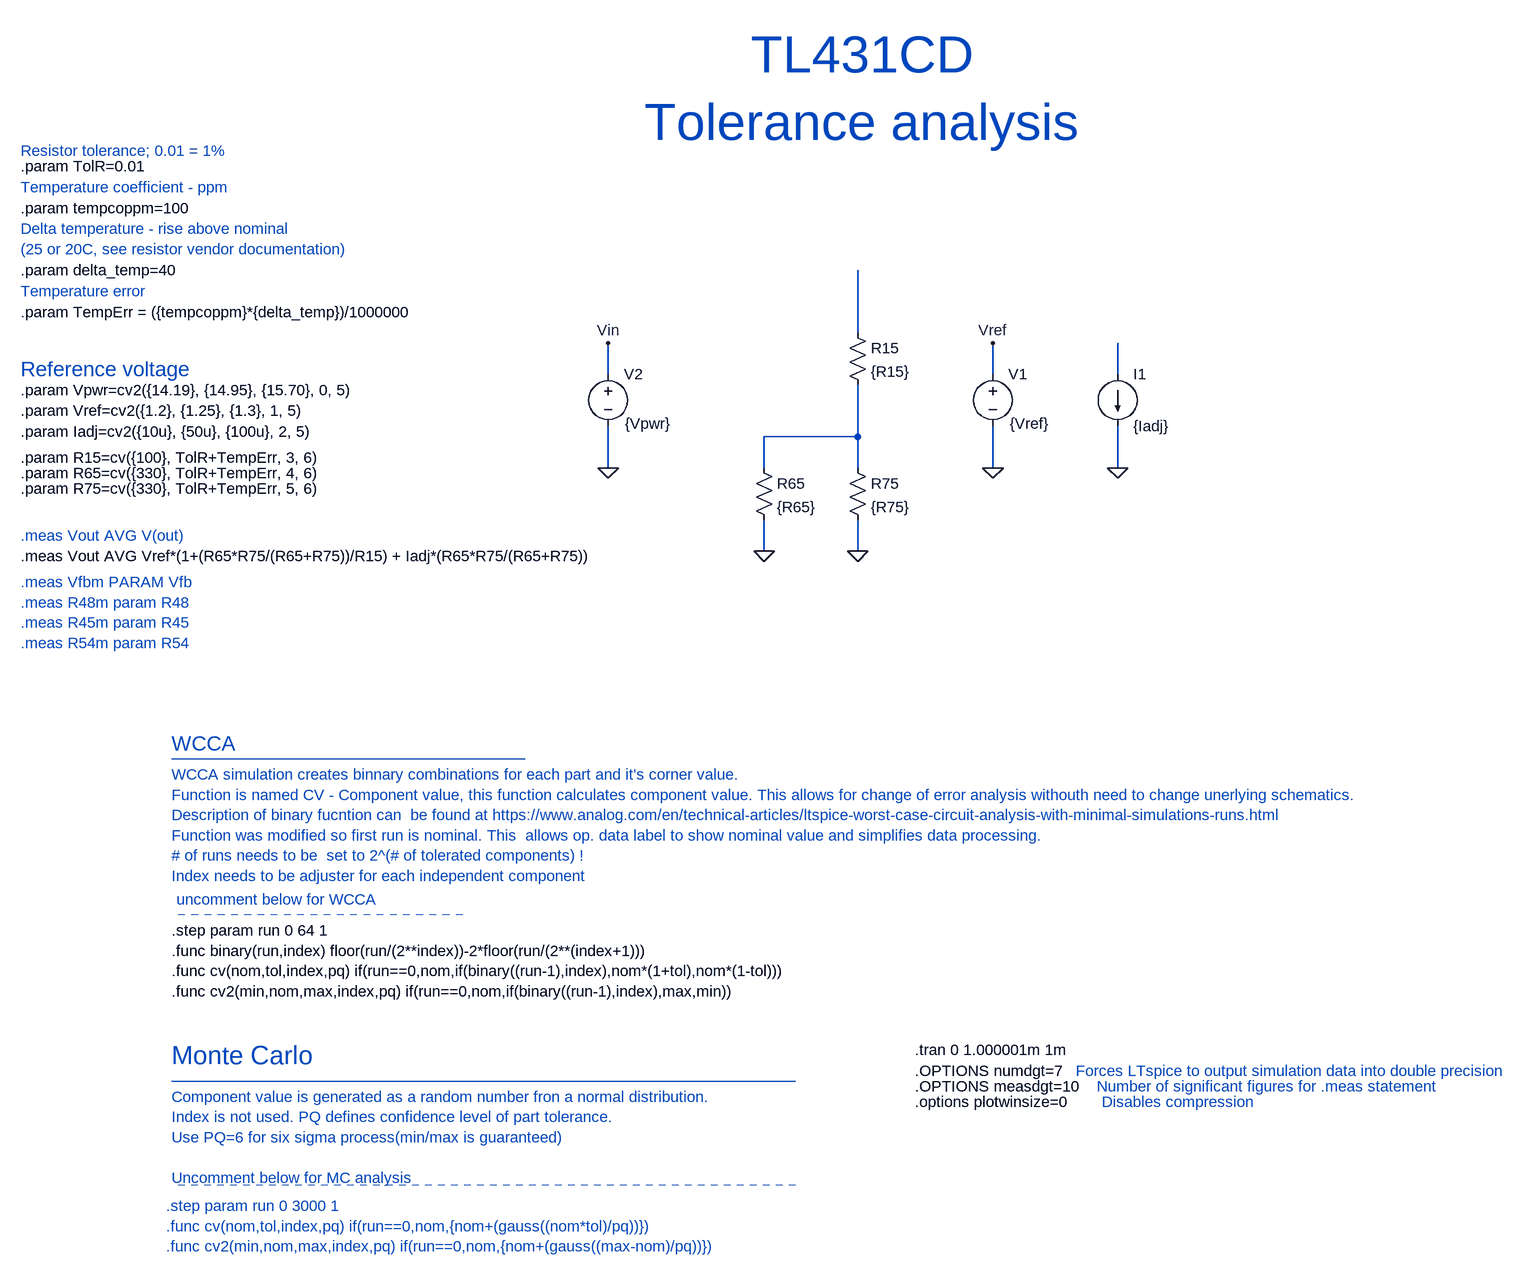
[diagram p0: schematic 3V3.asc]
3V3.asc, the LTspice schematic file:
Version 4
SHEET 1 3608 1236
WIRE 304 -976 304 -1072
WIRE -80 -912 -80 -960
WIRE 512 -912 512 -960
WIRE 704 -912 704 -960
WIRE 304 -816 304 -896
WIRE 304 -816 160 -816
WIRE -80 -768 -80 -832
WIRE 160 -768 160 -816
WIRE 304 -768 304 -816
WIRE 512 -768 512 -832
WIRE 704 -768 704 -832
WIRE 160 -640 160 -688
WIRE 304 -640 304 -688
FLAG 304 -640 0
FLAG 512 -768 0
FLAG -80 -768 0
FLAG -80 -960 Vin
FLAG 512 -960 Vref
FLAG 704 -768 0
FLAG 160 -640 0
SYMBOL res 288 -992 R0
SYMATTR InstName R15
SYMATTR Value {R15}
SYMBOL res 288 -784 R0
SYMATTR InstName R75
SYMATTR Value {R75}
SYMBOL voltage 512 -928 R0
WINDOW 3 26 92 Left 2
WINDOW 123 0 0 Left 0
WINDOW 39 0 0 Left 0
SYMATTR Value {Vref}
SYMATTR InstName V1
SYMBOL res 144 -784 R0
SYMATTR InstName R65
SYMATTR Value {R65}
SYMBOL voltage -80 -928 R0
WINDOW 3 26 92 Left 2
WINDOW 123 0 0 Left 0
WINDOW 39 0 0 Left 0
SYMATTR Value {Vpwr}
SYMATTR InstName V2
SYMBOL current 704 -912 R0
SYMATTR InstName I1
SYMATTR Value {Iadj}
TEXT 392 128 Left 2 !.tran 0 1.000001m 1m
TEXT -752 -56 Left 2 !.step param run 0 64 1\n.func binary(run,index) floor(run/(2**index))-2*floor(run/(2**(index+1)))\n.func cv(nom,tol,index,pq) if(run==0,nom,if(binary((run-1),index),nom*(1+tol),nom*(1-tol)))\n.func cv2(min,nom,max,index,pq) if(run==0,nom,if(binary((run-1),index),max,min))
TEXT -752 -296 Left 2 ;WCCA simulation creates binnary combinations for each part and it's corner value. \nFunction is named CV - Component value, this function calculates component value. This allows for change of error analysis withouth need to change unerlying schematics.\nDescription of binary fucntion can  be found at https://www.analog.com/en/technical-articles/ltspice-worst-case-circuit-analysis-with-minimal-simulations-runs.html\nFunction was modified so first run is nominal. This  allows op. data label to show nominal value and simplifies data processing.\n# of runs needs to be  set to 2^(# of tolerated components) !\nIndex needs to be adjuster for each independent component
TEXT -984 -1256 Left 2 ;Resistor tolerance; 0.01 = 1%
TEXT -984 -592 Left 2 ;.meas Vfbm PARAM Vfb\n.meas R48m param R48\n.meas R45m param R45\n.meas R54m param R54
TEXT -752 -344 Left 3 ;WCCA
TEXT -744 -104 Left 2 ;uncomment below for WCCA
TEXT 392 184 Left 2 !.OPTIONS measdgt=10
TEXT 392 160 Left 2 !.OPTIONS numdgt=7
TEXT 672 184 Left 2 ;Number of significant figures for .meas statement
TEXT 640 160 Left 2 ;Forces LTspice to output simulation data into double precision
TEXT 392 208 Left 2 !.options plotwinsize=0
TEXT 680 208 Left 2 ;Disables compression
TEXT -984 -1232 Left 2 !.param TolR=0.01
TEXT -984 -1168 Left 2 !.param tempcoppm=100
TEXT -984 -1200 Left 2 ;Temperature coefficient - ppm
TEXT -984 -1072 Left 2 !.param delta_temp=40
TEXT -984 -1008 Left 2 !.param TempErr = ({tempcoppm}*{delta_temp})/1000000
TEXT -984 -1136 Left 2 ;Delta temperature - rise above nominal \n(25 or 20C, see resistor vendor documentation)
TEXT -984 -1040 Left 2 ;Temperature error
TEXT -984 -784 Left 2 !.param R15=cv({100}, TolR+TempErr, 3, 6)
TEXT -984 -920 Left 3 ;Reference voltage
TEXT -984 -888 Left 2 !.param Vpwr=cv2({14.19}, {14.95}, {15.70}, 0, 5)
TEXT -760 368 Left 2 ;.step param run 0 3000 1\n.func cv(nom,tol,index,pq) if(run==0,nom,{nom+(gauss((nom*tol)/pq))})\n.func cv2(min,nom,max,index,pq) if(run==0,nom,{nom+(gauss((max-nom)/pq))})
TEXT -752 136 Left 4 ;Monte Carlo
TEXT -752 200 Left 2 ;Component value is generated as a random number fron a normal distribution. \nIndex is not used. PQ defines confidence level of part tolerance. \nUse PQ=6 for six sigma process(min/max is guaranteed)\n \nUncomment below for MC analysis
TEXT -984 -632 Left 2 !.meas Vout AVG Vref*(1+(R65*R75/(R65+R75))/R15) + Iadj*(R65*R75/(R65+R75))
TEXT 312 -1352 Center 6 ;TL431CD\nTolerance analysis
TEXT -984 -664 Left 2 ;.meas Vout AVG V(out)
TEXT -984 -856 Left 2 !.param Vref=cv2({1.2}, {1.25}, {1.3}, 1, 5)
TEXT -984 -760 Left 2 !.param R65=cv({330}, TolR+TempErr, 4, 6)
TEXT -984 -736 Left 2 !.param R75=cv({330}, TolR+TempErr, 5, 6)
TEXT -984 -824 Left 2 !.param Iadj=cv2({10u}, {50u}, {100u}, 2, 5)
LINE Normal -208 -320 -752 -320
LINE Normal -304 -80 -752 -80 2
LINE Normal 208 176 -752 176
LINE Normal 208 336 -752 336 2

The netlist it stands for:
* 3V3.asc
R15 N001 N003 {R15}
R75 N003 0 {R75}
V1 Vref 0 {Vref}
R65 N003 0 {R65}
V2 Vin 0 {Vpwr}
I1 N002 0 {Iadj}
.tran 0 1.000001m 1m
.step param run 0 64 1
.func binary(run,index) floor(run/(2**index))-2*floor(run/(2**(index+1)))
.func cv(nom,tol,index,pq) if(run==0,nom,if(binary((run-1),index),nom*(1+tol),nom*(1-tol)))
.func cv2(min,nom,max,index,pq) if(run==0,nom,if(binary((run-1),index),max,min))
* WCCA simulation creates binnary combinations for each part and it's corner value.
* Function is named CV - Component value, this function calculates component value. This allows for change of error analysis withouth need to change unerlying schematics.
* Description of binary fucntion can  be found at https://www.analog.com/en/technical-articles/ltspice-worst-case-circuit-analysis-with-minimal-simulations-runs.html
* Function was modified so first run is nominal. This  allows op. data label to show nominal value and simplifies data processing.
* # of runs needs to be  set to 2^(# of tolerated components) !
* Index needs to be adjuster for each independent component
* Resistor tolerance; 0.01 = 1%
* .meas Vfbm PARAM Vfb
* .meas R48m param R48
* .meas R45m param R45
* .meas R54m param R54
* WCCA
* uncomment below for WCCA
.OPTIONS measdgt=10
.OPTIONS numdgt=7
* Number of significant figures for .meas statement
* Forces LTspice to output simulation data into double precision
.options plotwinsize=0
* Disables compression
.param TolR=0.01
.param tempcoppm=100
* Temperature coefficient - ppm
.param delta_temp=40
.param TempErr = ({tempcoppm}*{delta_temp})/1000000
* Delta temperature - rise above nominal
* (25 or 20C, see resistor vendor documentation)
* Temperature error
.param R15=cv({100}, TolR+TempErr, 3, 6)
* Reference voltage
.param Vpwr=cv2({14.19}, {14.95}, {15.70}, 0, 5)
* .step param run 0 3000 1
* .func cv(nom,tol,index,pq) if(run==0,nom,{nom+(gauss((nom*tol)/pq))})
* .func cv2(min,nom,max,index,pq) if(run==0,nom,{nom+(gauss((max-nom)/pq))})
* Monte Carlo
* Component value is generated as a random number fron a normal distribution.
* Index is not used. PQ defines confidence level of part tolerance.
* Use PQ=6 for six sigma process(min/max is guaranteed)
* Uncomment below for MC analysis
.meas Vout AVG Vref*(1+(R65*R75/(R65+R75))/R15) + Iadj*(R65*R75/(R65+R75))
* TL431CD
* Tolerance analysis
* .meas Vout AVG V(out)
.param Vref=cv2({1.2}, {1.25}, {1.3}, 1, 5)
.param R65=cv({330}, TolR+TempErr, 4, 6)
.param R75=cv({330}, TolR+TempErr, 5, 6)
.param Iadj=cv2({10u}, {50u}, {100u}, 2, 5)
.backanno
.end